# Altium schematic sheet FPSInterface.SchDoc: Название платы
size 594 x 420 mm; ApprovedBy: Рогов; CheckedBy: Фамилия проверяющего; DrawnBy: Фамилия разработчика; DocumentNumber: Введите номер платы + Э3; SheetNumber: пусто если листов 1, иначе 1; SheetTotal: количество листов; Format: A2; DocumentType: тип схемы; Title1str: (вторая строка при необходимости); ImagePath: Введите номер платы
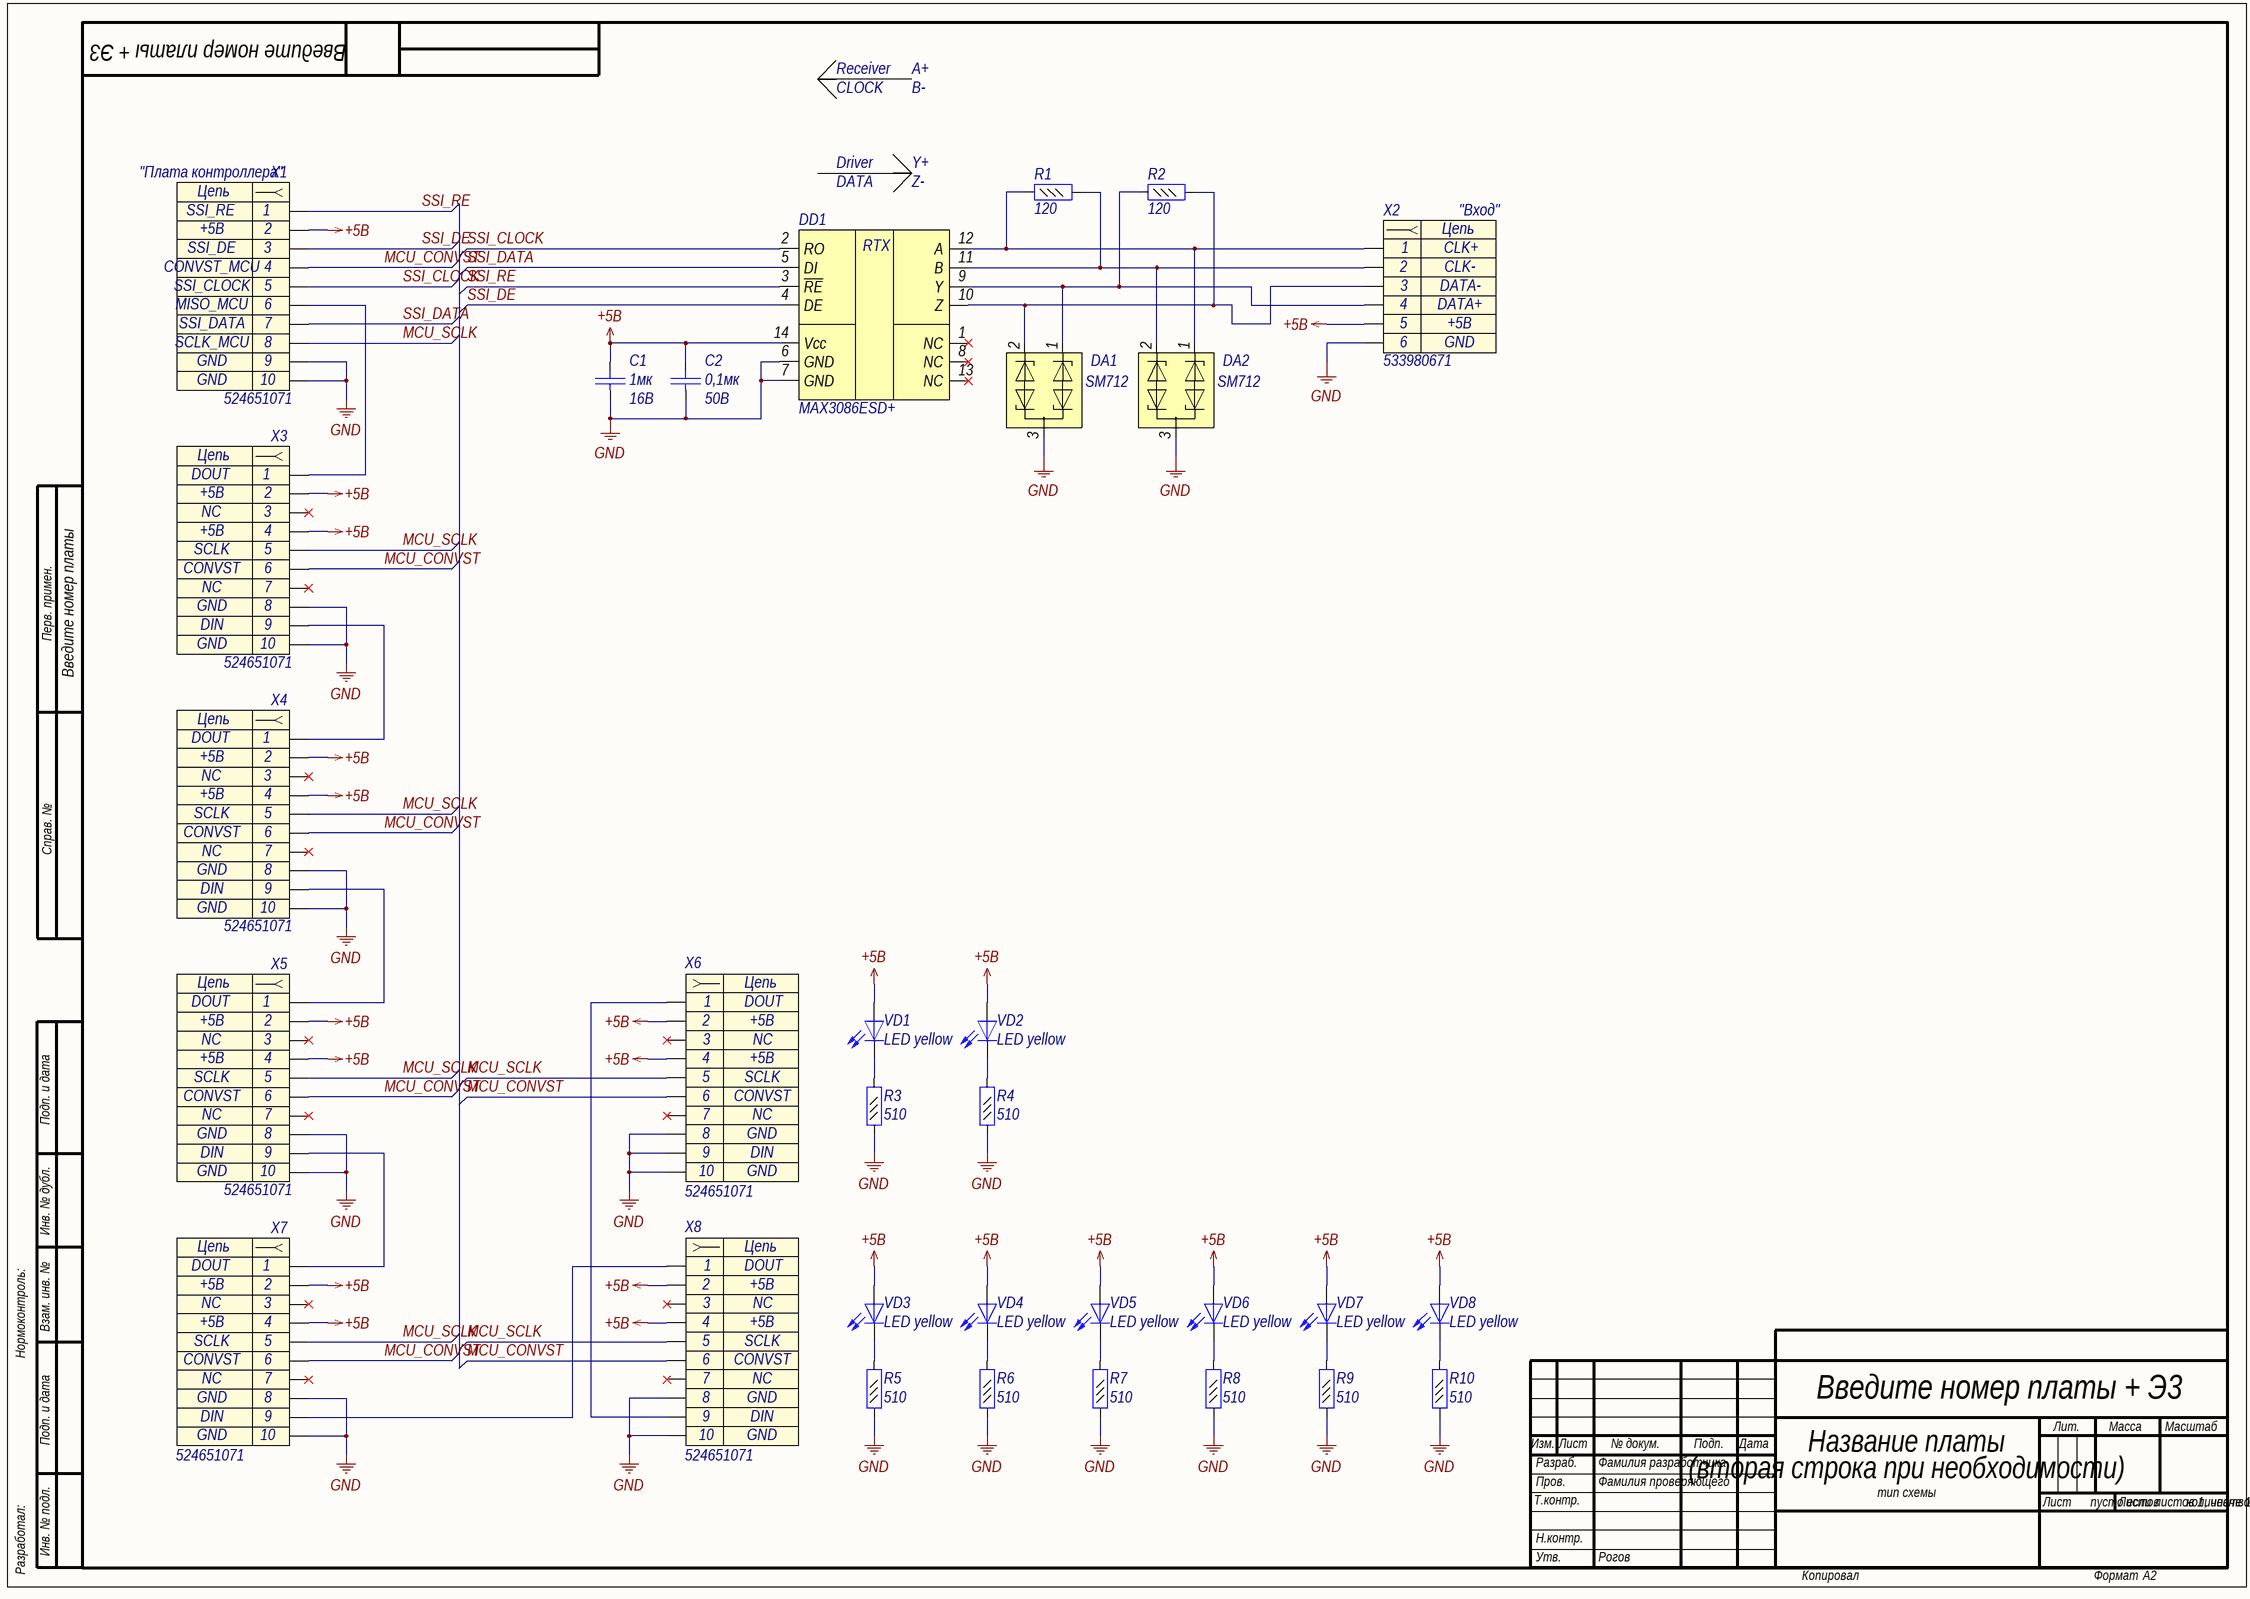
[diagram p0: FPSInterface.SchDoc]

## Parts
C1  value 1мк  Voltage: 16B  [C0603]  (hidden comment: Capacitor)
C2  value 0,1мк  Voltage: 50В  [C0402]  (hidden comment: Capacitor)
DA1  SM712  [SOT23-3]
DA2  SM712  [SOT23-3]
DD1  Part Number: MAX3086ESD+  [SO14]
R1  value 120  [R0402]  (hidden comment: Resistor_0,062Вт)
R2  value 120  [R0402]  (hidden comment: Resistor_0,062Вт)
R3  value 510  [R0402]  (hidden comment: Resistor_0,062Вт)
R4  value 510  [R0402]  (hidden comment: Resistor_0,062Вт)
R5  value 510  [R0402]  (hidden comment: Resistor_0,062Вт)
R6  value 510  [R0402]  (hidden comment: Resistor_0,062Вт)
R7  value 510  [R0402]  (hidden comment: Resistor_0,062Вт)
R8  value 510  [R0402]  (hidden comment: Resistor_0,062Вт)
R9  value 510  [R0402]  (hidden comment: Resistor_0,062Вт)
R10  value 510  [R0402]  (hidden comment: Resistor_0,062Вт)
VD1  Part Name: LED yellow  [L_0402_YELLOW]  (hidden comment: LED)
VD2  Part Name: LED yellow  [L_0402_YELLOW]  (hidden comment: LED)
VD3  Part Name: LED yellow  [L_0402_YELLOW]  (hidden comment: LED)
VD4  Part Name: LED yellow  [L_0402_YELLOW]  (hidden comment: LED)
VD5  Part Name: LED yellow  [L_0402_YELLOW]  (hidden comment: LED)
VD6  Part Name: LED yellow  [L_0402_YELLOW]  (hidden comment: LED)
VD7  Part Name: LED yellow  [L_0402_YELLOW]  (hidden comment: LED)
VD8  Part Name: LED yellow  [L_0402_YELLOW]  (hidden comment: LED)
X1  "Плата контроллера"  Part Number: 524651071  [SlimStack-10pin-vert-sct]
X2  "Вход"  Part Number: 533980671  [MOLEX_533980671]
X3  Part Number: 524651071  [SlimStack-10pin-vert-sct]  (hidden comment: Header_10_sct)
X4  Part Number: 524651071  [SlimStack-10pin-vert-sct]  (hidden comment: Header_10_sct)
X5  Part Number: 524651071  [SlimStack-10pin-vert-sct]  (hidden comment: Header_10_sct)
X6  Part Number: 524651071  [SlimStack-10pin-vert-sct]  (hidden comment: Header_10_sct)
X7  Part Number: 524651071  [SlimStack-10pin-vert-sct]  (hidden comment: Header_10_sct)
X8  Part Number: 524651071  [SlimStack-10pin-vert-sct]  (hidden comment: Header_10_sct)

## Nets
+5B: C1.2 C2.2 DD1.14(Vcc) VD1.2(A) VD2.2(A) VD3.2(A) VD4.2(A) VD5.2(A) VD6.2(A) VD7.2(A) VD8.2(A) X1.2 X2.5 X3.2 X3.4 X4.2 X4.4 X5.2 X5.4 X6.2 X6.4 X7.2 X7.4 X8.2 X8.4
GND: C1.1 C2.1 DA1.3 DA2.3 DD1.6(GND) DD1.7(GND) R3.1 R4.1 R5.1 R6.1 R7.1 R8.1 R9.1 R10.1 X1.9 X1.10 X2.6 X3.8 X3.10 X4.8 X4.10 X5.8 X5.10 X6.8 X6.9 X6.10 X7.8 X7.10 X8.8 X8.10
MCU_CONVST: X1.4 X3.6 X4.6 X5.6 X6.6 X7.6 X8.6
MCU_SCLK: X1.8 X3.5 X4.5 X5.5 X6.5 X7.5 X8.5
SSI_CLOCK: DD1.2(RO) X1.5
SSI_DATA: DD1.5(DI) X1.7
SSI_DE: DD1.4(DE) X1.3
SSI_RE: DD1.3(~{RE}) X1.1
NetDA1_1: DA1.1 DD1.9(Y) R2.1 X2.4
NetDA1_2: DA1.2 DD1.10(Z) R2.2 X2.3
NetDA2_1: DA2.1 DD1.12(A) R1.1 X2.1
NetDA2_2: DA2.2 DD1.11(B) R1.2 X2.2
NetR3_2: R3.2 VD1.1(K)
NetR4_2: R4.2 VD2.1(K)
NetR5_2: R5.2 VD3.1(K)
NetR6_2: R6.2 VD4.1(K)
NetR7_2: R7.2 VD5.1(K)
NetR8_2: R8.2 VD6.1(K)
NetR9_2: R9.2 VD7.1(K)
NetR10_2: R10.2 VD8.1(K)
NetX1_6: X1.6 X3.1
NetX3_9: X3.9 X4.1
NetX4_9: X4.9 X5.1
NetX5_9: X5.9 X7.1
NetX6_1: X6.1 X8.9
NetX7_9: X7.9 X8.1

Not connected (* = marked no-connect by the designer): DD1 1(NC)* 8(NC)* 13(NC)*; X3 3* 7*; X4 3* 7*; X5 3* 7*; X6 3* 7*; X7 3* 7*; X8 3* 7*

## Notes on the sheet
- CLOCK
- Receiver
- A+
- B-
- Driver
- Y+
- DATA
- Z-
- Перв. примен.
- Справ. №
- Подп. и дата
- Инв. № дубл.
- Нормоконтроль:
- Взам. инв. №
- Изм.
- Лист
- № докум.
- Подп.
- Дата
- Лит.
- Масса
- Масштаб
- Т.контр.
- Пров.
- Разраб.
- Листов
- Разработал:
- Инв. № подл.
- Н.контр.
- Утв.
- Копировал
- Формат
- (in symbol connect225) Цепь
- (in symbol connect226) Цепь
- (in symbol interf33) RTX

## Library data of the parts
C1 = cap133: Конденсатор; Part Name: Ceramic; Manufacture: Murata; Part Number: GRM188R71C105KA12D**; id: cap133; TKE: X7R
C2 = cap277: Конденсатор; Part Name: Ceramic; Manufacture: Murata; Part Number: GRM155R71H104KE14D; id: cap277; TKE: X7R; tga: 0,10%
DA1 DA2 = diode4: TVS; Part Name: TVS diode RS-485; Part Number: SM712.TCT; Manufacture: Semtech; id: diode4; Reverse Current: 1mA; Number: 2
DD1 = interf33: Fail-Safe, High-Speed (10Mbps),  Slew-Rate-Limited RS-485/RS-422 Transceivers; Manufacture: Maxim Integrated; Interface: RS422/485; Mode of Work: Full-Duplex; Number of Channel: 2; Type Supply: Single Polar; Current Consumption: 900uA; Power Supply: 4.75-5.25V; id: interf33; Part Name: RS-485/RS-422 Transceivers; Speed: 10Mbps
R1 R2 = res248: Резистор; Manufacture: Yageo; Part Number: RC0402FR-07120RL; id: res248; Accuracy: 0,01; Part Name: Resistor; Power: 0,062Вт
R3-R10 = res263: Резистор; Manufacture: Yageo; Part Number: RC0402FR-07510RL; id: res263; Accuracy: 0,01; Part Name: Resistor; Power: 0,062Вт
VD1-VD8 = diode29: Светодиод; Part Number: KPHHS-1005SYCK; id: diode29
X1 = connect225: Разъем - 10 конт. розетка; Part Name: SlimStack Board-to-Board Connector; Manufacture: Molex; Contact_1: SSI_RE; Contact_2: +5B; Contact_3: SSI_DE; Contact_4: CONVST_MCU; Contact_5: SSI_CLOCK; Contact_6: MISO_MCU; Etch: 0.8mm; Contact_7: SSI_DATA; Contact_8: SCLK_MCU; Contact_9: GND; System: Connector; id: connect225; Contact_10: GND
X2 = connect226: Разъем - 6 конт. розетка; Part Name: PicoBlade PCB Header; Manufacture: Molex; Contact_1: CLK+; Contact_2: CLK-; Contact_3: DATA-; Contact_4: DATA+; Contact_5: +5B; Contact_6: GND; Etch: 1.25mm; id: connect226
X3 = connect225: Разъем - 10 конт. розетка; Part Name: SlimStack Board-to-Board Connector; Manufacture: Molex; Contact_1: DOUT; Contact_2: +5B; Contact_3: NC; Contact_4: +5В; Contact_5: SCLK; Contact_6: CONVST; Etch: 0.8mm; Contact_8: GND; Contact_9: DIN; System: Connector; id: connect225; Contact_7: NC; Contact_10: GND
X4-X8 = connect225: Разъем - 10 конт. розетка; Part Name: SlimStack Board-to-Board Connector; Manufacture: Molex; Contact_1: DOUT; Contact_2: +5B; Contact_3: NC; Contact_5: SCLK; Contact_6: CONVST; Etch: 0.8mm; Contact_8: GND; Contact_9: DIN; System: Connector; Contact_4: +5B; id: connect225; Contact_7: NC; Contact_10: GND